# Altium schematic sheet 101_Power.SchDoc: Power MainHub Part 2
size A2; Organization: Greenfield Tech Solutions; Address1: Molendreef 33; Address2: Ossendrecht; Address3: 4641CS; Address4: The Netherlands; SheetNumber: 2; SheetTotal: 9
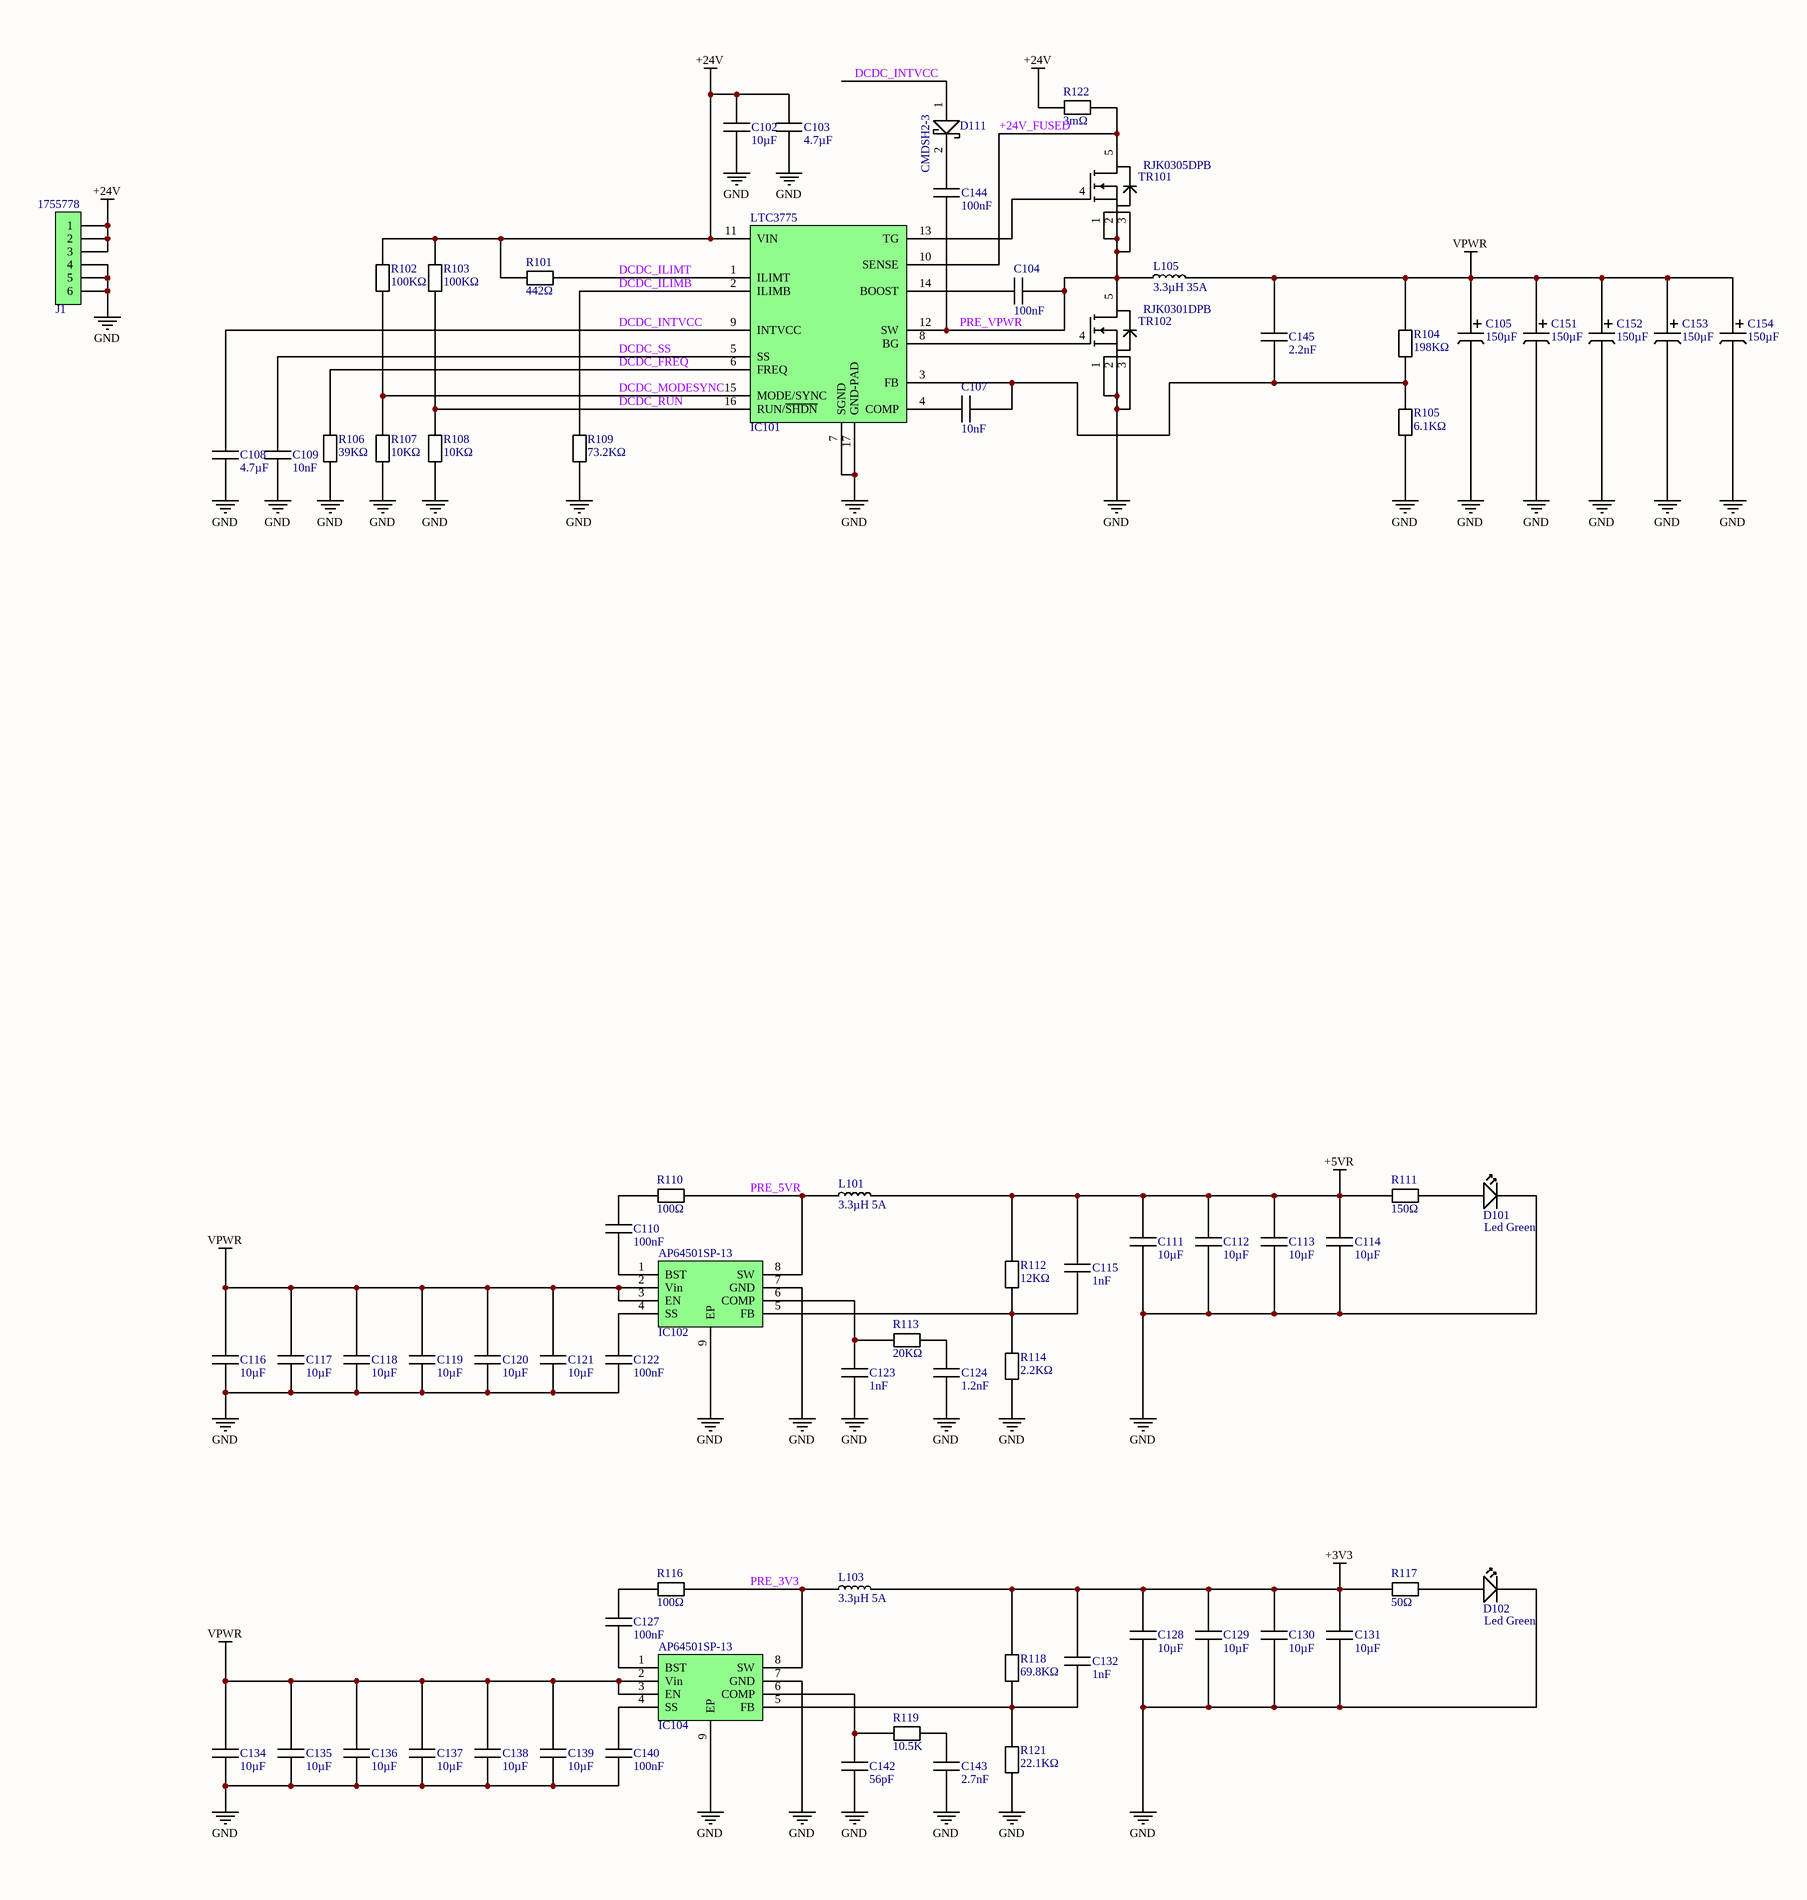
[diagram p0: 101_Power.SchDoc, left]
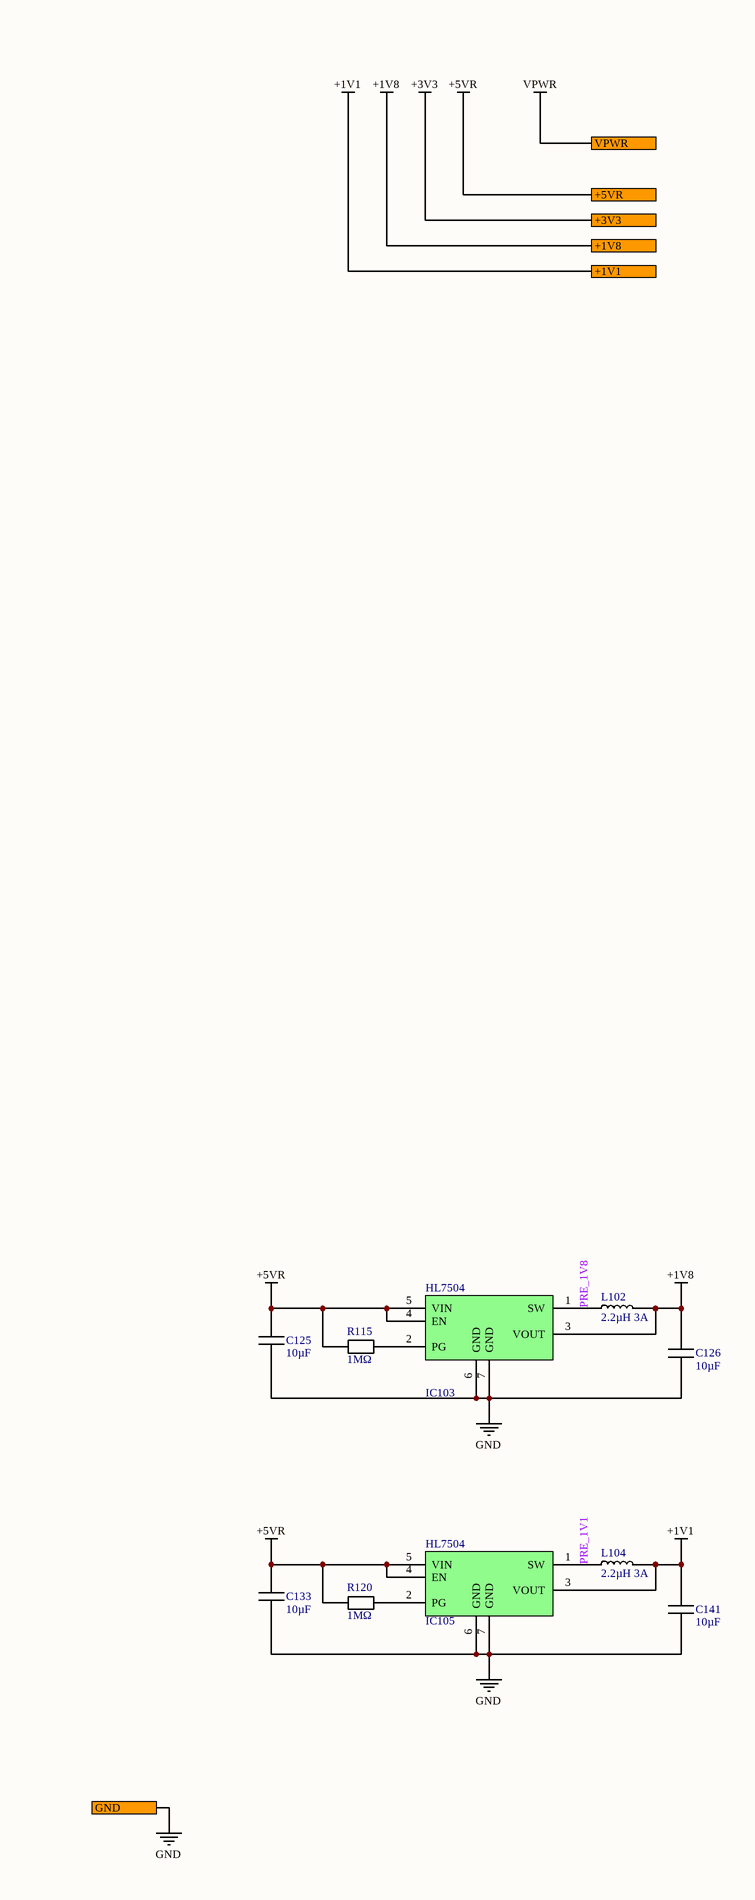
[diagram p1: 101_Power.SchDoc, right]

## Parts
C102  10µF  [C1210]
C103  4.7µF  [C1210]
C104  100nF  [C0402]
C105  150µF  [Tantalum_2924_4.1MM]
C107  10nF  [C0805]
C108  4.7µF  [C1210]
C109  10nF  [C0805]
C110  100nF  [C0402]
C111  10µF  [C0805]
C112  10µF  [C0805]
C113  10µF  [C0805]
C114  10µF  [C0805]
C115  1nF  [C0402]
C116  10µF  [C0805]
C117  10µF  [C0805]
C118  10µF  [C0805]
C119  10µF  [C0805]
C120  10µF  [C0805]
C121  10µF  [C0805]
C122  100nF  [C0402]
C123  1nF  [C0402]
C124  1.2nF  [C0402]
C125  10µF  [C0603]
C126  10µF  [C0603]
C127  100nF  [C0402]
C128  10µF  [C0805]
C129  10µF  [C0805]
C130  10µF  [C0805]
C131  10µF  [C0805]
C132  1nF  [C0402]
C133  10µF  [C0603]
C134  10µF  [C0805]
C135  10µF  [C0805]
C136  10µF  [C0805]
C137  10µF  [C0805]
C138  10µF  [C0805]
C139  10µF  [C0805]
C140  100nF  [C0402]
C141  10µF  [C0603]
C142  56pF  [C0402]
C143  2.7nF  [C0402]
C144  100nF  [C0402]
C145  2.2nF  [C0805]
C151  150µF  [Tantalum_2924_4.1MM]
C152  150µF  [Tantalum_2924_4.1MM]
C153  150µF  [Tantalum_2924_4.1MM]
C154  150µF  [Tantalum_2924_4.1MM]
D101  Led Green  [Led0805]
D102  Led Green  [Led0805]
D111  CMDSH2-3  [SOD-323]
IC101  LTC3775  [QFN-16G_3X3]
IC102  AP64501SP-13  [SO-8-EP]
IC103  HL7504  [DFN-6G_2X2]
IC104  AP64501SP-13  [SO-8-EP]
IC105  HL7504  [DFN-6G_2X2]
J1  1755778  [1755778]
L101  3.3µH 5A  [SRN6045TA]
L102  2.2µH 3A  [NRS4018]
L103  3.3µH 5A  [SRN6045TA]
L104  2.2µH 3A  [NRS4018]
L105  3.3µH 35A  [IN-2P_17X17]
R101  442Ω  [R0402]
R102  100KΩ  [R0402]
R103  100KΩ  [R0402]
R104  198KΩ  [R0603]
R105  6.1KΩ  [R0402]
R106  39KΩ  [R0402]
R107  10KΩ  [R0402]
R108  10KΩ  [R0402]
R109  73.2KΩ  [R0402]
R110  100Ω  [R0603]
R111  150Ω  [R0603]
R112  12KΩ  [R0402]
R113  20KΩ  [R0402]
R114  2.2KΩ  [R0402]
R115  1MΩ  [R0402]
R116  100Ω  [R0603]
R117  50Ω  [R0603]
R118  69.8KΩ  [R0603]
R119  10.5K  [R0402]
R120  1MΩ  [R0402]
R121  22.1KΩ  [R0603]
R122  3mΩ  [R1206]
TR101  RJK0305DPB  [LFPAK-5_4.9X4]
TR102  RJK0301DPB  [LFPAK-5_4.9X4]

## Ports
+1V1, +1V8, +3V3, +5VR, GND, VPWR

## Nets
+1V1: C141.1 IC105.3(VOUT) L104.2 ; port +1V1
+1V8: C126.1 IC103.3(VOUT) L102.2 ; port +1V8
+3V3: C128.1 C129.1 C130.1 C131.1 C132.1 L103.2 R117.1 R118.2 ; port +3V3
+5VR: C111.1 C112.1 C113.1 C114.1 C115.1 C125.1 C133.1 IC103.4(EN) IC103.5(VIN) IC105.4(EN) IC105.5(VIN) L101.2 R111.1 R112.2 R115.1 R120.1 ; port +5VR
+24V: C102.1 C103.1 IC101.11(VIN) J1.1 J1.2 J1.3 R101.2 R102.2 R103.2 R122.1
GND: C102.2 C103.2 C105.2 C108.2 C109.2 C111.2 C112.2 C113.2 C114.2 C116.2 C117.2 C118.2 C119.2 C120.2 C121.2 C122.2 C123.2 C124.2 C125.2 C126.2 C128.2 C129.2 C130.2 C131.2 C133.2 C134.2 C135.2 C136.2 C137.2 C138.2 C139.2 C140.2 C141.2 C142.2 C143.2 C151.2 C152.2 C153.2 C154.2 D101.K D102.K IC101.7(SGND) IC101.17(GND-PAD) IC102.7(GND) IC102.9(EP) IC103.6(GND) IC103.7(GND) IC104.7(GND) IC104.9(EP) IC105.6(GND) IC105.7(GND) J1.4 J1.5 J1.6 R105.1 R106.1 R107.1 R108.1 R109.1 R114.1 R121.1 TR102.1(S) TR102.2(S) TR102.3(S) ; port GND
VPWR: C105.1 C116.1 C117.1 C118.1 C119.1 C120.1 C121.1 C134.1 C135.1 C136.1 C137.1 C138.1 C139.1 C145.1 C151.1 C152.1 C153.1 C154.1 IC102.2(Vin) IC102.3(EN) IC104.2(Vin) IC104.3(EN) L105.2 R104.2 ; port VPWR
+24V_FUSED: IC101.10(SENSE) R122.2 TR101.5(D)
DCDC_FREQ: IC101.6(FREQ) R106.2
DCDC_ILIMB: IC101.2(ILIMB) R109.2
DCDC_ILIMT: IC101.1(ILIMT) R101.1
DCDC_INTVCC: C108.1 D111.1(A) IC101.9(INTVCC)
DCDC_MODESYNC: IC101.15(MODE/SYNC) R102.1 R107.2
DCDC_RUN: IC101.16(RUN/~{SHDN}) R103.1 R108.2
DCDC_SS: C109.1 IC101.5(SS)
PRE_1V1: IC105.1(SW) L104.1
PRE_1V8: IC103.1(SW) L102.1
PRE_3V3: IC104.8(SW) L103.1 R116.2
PRE_5VR: IC102.8(SW) L101.1 R110.2
PRE_VPWR: C104.2 C144.2 IC101.12(SW) L105.1 TR101.1(S) TR101.2(S) TR101.3(S) TR102.5(D)
NetC104_1: C104.1 IC101.14(BOOST)
NetC107_1: C107.1 IC101.4(COMP)
NetC107_2: C107.2 C145.2 IC101.3(FB) R104.1 R105.2
NetC110_1: C110.1 R110.1
NetC110_2: C110.2 IC102.1(BST)
NetC115_2: C115.2 IC102.5(FB) R112.1 R114.2
NetC122_1: C122.1 IC102.4(SS)
NetC123_1: C123.1 IC102.6(COMP) R113.2
NetC124_1: C124.1 R113.1
NetC127_1: C127.1 R116.1
NetC127_2: C127.2 IC104.1(BST)
NetC132_2: C132.2 IC104.5(FB) R118.1 R121.2
NetC140_1: C140.1 IC104.4(SS)
NetC142_1: C142.1 IC104.6(COMP) R119.2
NetC143_1: C143.1 R119.1
NetC144_1: C144.1 D111.2(K)
NetD101_A: D101.A R111.2
NetD102_A: D102.A R117.2
NetIC101_8: IC101.8(BG) TR102.4(G)
NetIC101_13: IC101.13(TG) TR101.4(G)
NetIC103_2: IC103.2(PG) R115.2
NetIC105_2: IC105.2(PG) R120.2

## Notes on the sheet
- Title
- Size:
- Date:
- File:
- A2
- Number:
- Time:
- Revision:
- Sheet
- of

## Library data of the parts
C102 = CA0024: 10µF 63V 10% X7R; Part Number: CA0024; ManfactPart: GRM32ER71J106KA12; ID: 24; RefVal: 10µF
C103 C108 = CA0038: 4.7µF 100V 10% X5R; Part Number: CA0038; ManfactPart: HMK325BJ475KM-PE; ID: 38; RefVal: 4.7µF
C104 C110 C122 C127 C140 C144 = CA0029: 100nF 50V 10% X7R; Part Number: CA0029; ManfactPart: CGA2B3X7R1H104K050BB; ID: 29; RefVal: 100nF
C105 C151-C154 = CA0076: 150µF 35V 20% 100mΩ; Part Number: CA0076; ManfactPart: TCJU157M035R0100E; ID: 76; RefVal: 150µF
C107 C109 = CA0021: 10nF 50V 10% X7R; Part Number: CA0021; ManfactPart: C0805C103K5RAC; ID: 21; RefVal: 10nF
C111-C114 C128-C131 = CA0001: 10µF 16V 10% X5R; Part Number: CA0001; ManfactPart: GRM21BR61C106KE15L; ID: 1; RefVal: 10µF
C115 C123 C132 = CA0031: 1nF 50V 1% C0G; Part Number: CA0031; ManfactPart: GRT1555C1H102FA02D; ID: 31; RefVal: 1nF
C116-C121 C134-C139 = CA0005: 10µF 35V 10% X5R; Part Number: CA0005; ManfactPart: C2012X5R1V106K125AC; ID: 5; RefVal: 10µF
C124 = CA0030: 1.2nF 50V 10% X7R; Part Number: CA0030; ManfactPart: GCM155R71H122KA37D; ID: 30; RefVal: 1.2nF
C125 C126 C133 C141 = CA0008: 10µF 16V 20% X5R; Part Number: CA0008; ManfactPart: GRM188R61C106MAALD; ID: 8; RefVal: 10µF
C142 = CA0068: 56pF 50V 2% C0G; Part Number: CA0068; ManfactPart: CC0402GRNPO9BN560; ID: 68; RefVal: 56pF
C143 = CA0055: 2.7nF 50V 5% X7R; Part Number: CA0055; ManfactPart: GRM155R71H272JA01D; ID: 55; RefVal: 2.7nF
C145 = CA0070: 2.2nF 50V 10% X7R; Part Number: CA0070; ManfactPart: C0805C222K5RAC; ID: 70; RefVal: 2.2nF
D101 D102 = DI0001: Part Number: DI0001; ManfactPart: KP-2012CGCK; ID: 1; RefVal: Led Green
D111 = DI0013: Schottky Diodes 30V; Part Number: DI0013; ManfactPart: CMDSH2-3 TR PBFREE; ID: 13; RefVal: CMDSH2-3
IC101 = IC0063: High Frequency Synchronous Step-Down Voltage Mode DC/DC Controller; Part Number: IC0063; ManfactPart: LTC3775IUD#PBF; ID: 63; RefVal: LTC3775
IC102 IC104 = IC0031: 3.8V TO 40V INPUT, 5A LOW IQ SYNCHRONOUS BUCK WITH PROGRAMMABLE SOFT-START TIME; Part Number: IC0031; ID: 31; RefVal: AP64501SP-13; ManfactPart: AP64501SP-13
IC103 = IC0064: 3MHz 2A Buck Converter 1.80V OUT; Part Number: IC0064; ManfactPart: HL7504FN07; ID: 64; RefVal: HL7504
IC105 = IC0050: 3MHz 2A Buck Converter 1.10V OUT; Part Number: IC0050; ManfactPart: HL7504FN08; ID: 50; RefVal: HL7504
J1 = CO0033: Pluggable Terminal Blocks 6 Pos 5.08mm pitch Through Hole Header; Part Number: CO0033; ID: 33; RefVal: 1755778; ManfactPart: 1755778
L101 L103 = IN0005: 3.3µH 5A 30% 21mΩ; Part Number: IN0005; ManfactPart: SRN6045TA-3R3Y; ID: 5; RefVal: 3.3µH 5A
L102 L104 = IN0004: Part Number: IN0004; ManfactPart: NRS4018T2R2MDGJ; ID: 4; RefVal: 2.2µH 3A
L105 = IN0018: 3.3µH 35A 20% 2.93mΩ; Part Number: IN0018; ManfactPart: IHLP6767GZER3R3M11; ID: 18; RefVal: 3.3µH 35A
R101 = RS0083: 442Ω 1% 100mW 100PPM; Part Number: RS0083; ManfactPart: ERJ-2RKF4420X; ID: 83; RefVal: 442Ω
R102 R103 = RS0036: 100KΩ 1% 62.5mW 100PPM; Part Number: RS0036; ManfactPart: AC0402FR-13100KL; ID: 36; RefVal: 100KΩ
R104 = RS0088: 198KΩ 0.1% 100mW 25PPM; Part Number: RS0088; ManfactPart: RT0603BRD07198KL; ID: 88; RefVal: 198KΩ
R105 = RS0084: 6.1KΩ 0.1% 100mW 25PPM; Part Number: RS0084; ManfactPart: TNPW040236K1BEED; ID: 84; RefVal: 6.1KΩ
R106 = RS0089: 39KΩ 1% 62.5mW 100PPM; Part Number: RS0089; ManfactPart: CRG0402F39K; ID: 89; RefVal: 39KΩ
R107 R108 = RS0011: 10KΩ 1% 62.5mW; Part Number: RS0011; ManfactPart: WR04X1002FTL; ID: 11; RefVal: 10KΩ
R109 = RS0090: 73.2KΩ 1% 100mW 100PPM; Part Number: RS0090; ManfactPart: RK73H1ETTP7322F; ID: 90; RefVal: 73.2KΩ
R110 R116 = RS0007: 100Ω 1% 100mW; Part Number: RS0007; ManfactPart: WR06X1000FTL; ID: 7; RefVal: 100Ω
R111 = RS0001: 150Ω 1% 100mW; Part Number: RS0001; ManfactPart: MCWR06X1500FTL; ID: 1; RefVal: 150Ω
R112 = RS0015: 12KΩ 1% 62.5mW; Part Number: RS0015; ManfactPart: RC0402FR-1312KL; ID: 15; RefVal: 12KΩ
R113 = RS0034: 20KΩ 1% 100mW 100PPM; Part Number: RS0034; ManfactPart: ERJ-S02F2002X; ID: 34; RefVal: 20KΩ
R114 = RS0035: 2.2KΩ 1% 62.5mW 100PPM; Part Number: RS0035; ManfactPart: CRGCQ0402F2K2; ID: 35; RefVal: 2.2KΩ
R115 R120 = RS0066: 1MΩ 1% 62.5mW 100PPM; Part Number: RS0066; ManfactPart: 0402WGF1004TCE; ID: 66; RefVal: 1MΩ
R117 = RS0080: 50Ω 0.1% 100mW 50PPM; Part Number: RS0080; ManfactPart: RT0603BRE0750RL; ID: 80; RefVal: 50Ω
R118 = RS0041: 69.8KΩ 1% 100mW 100PPM; Part Number: RS0041; ManfactPart: CRCW060369K8FKEB; ID: 41; RefVal: 69.8KΩ
R119 = RS0054: 10.5KΩ 1% 62.5mW 100PPM; Part Number: RS0054; ManfactPart: CRCW040210K5FKEDC; ID: 54; RefVal: 10.5K
R121 = RS0040: 22.1KΩ 1% 100mW 100PPM; Part Number: RS0040; ManfactPart: RC0603FR-0722K1L; ID: 40; RefVal: 22.1KΩ
R122 = RS0091: 3mΩ 5% 250mW 100PPM; Part Number: RS0091; ManfactPart: AC1206JR-073ML; ID: 91; RefVal: 3mΩ
TR101 = TR0015: 30V/8mΩ, N-channel Power MOSFET, 30A; Part Number: TR0015; ID: 15; RefVal: RJK0305DPB; ManfactPart: RJK0305DPB
TR102 = TR0014: 30V/2.8mΩ, N-channel Power MOSFET, 60A; Part Number: TR0014; ID: 14; RefVal: RJK0301DPB; ManfactPart: RJK0301DPB